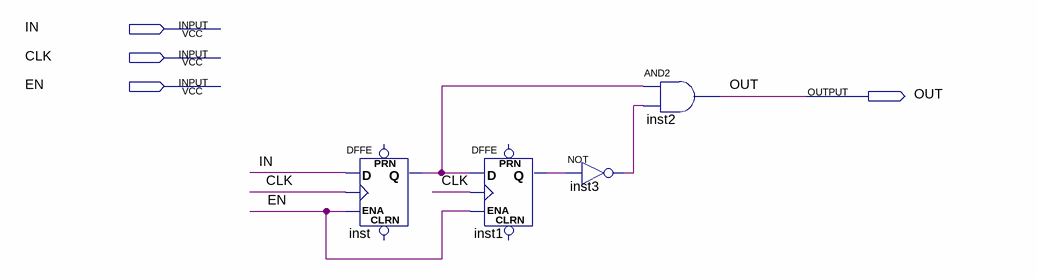
[diagram p0: schematic sheet]
// Quartus schematic imp_one_clk.bdf as structural Verilog: 4 symbols, 4 pins
module imp_one_clk (
  input  IN,
  input  CLK,
  input  EN,
  output OUT
);

  wire inst1_q, inst3_out, inst_q;

  DFFE inst (.D(IN), .CLK(CLK), .ENA(EN), .Q(inst_q));  // open: PRN, CLRN
  DFFE inst1 (.D(inst_q), .CLK(CLK), .ENA(EN), .Q(inst1_q));  // open: PRN, CLRN
  not inst3 (inst3_out, inst1_q);
  and inst2 (OUT, inst_q, inst3_out);
endmodule
